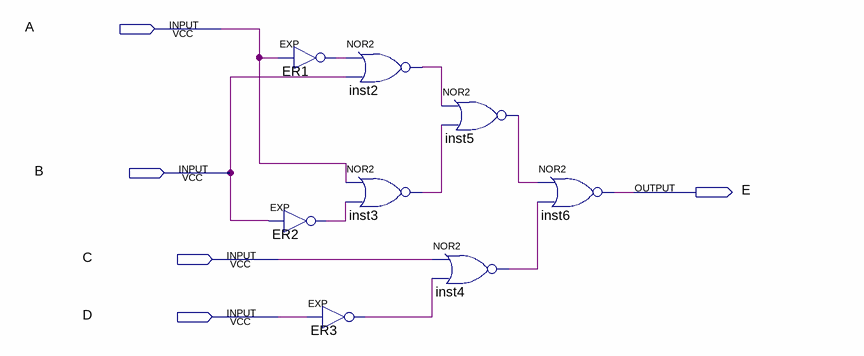
[diagram p0: schematic sheet]
// Quartus schematic lab1.bdf as structural Verilog: 8 symbols, 5 pins
module lab1 (
  input  A,
  input  B,
  input  C,
  input  D,
  output E
);

  wire ER1_out, ER2_out, ER3_out, inst2_out, inst3_out, inst4_out, inst5_out;

  EXP ER1 (.IN(A), .OUT(ER1_out));
  EXP ER2 (.IN(B), .OUT(ER2_out));
  EXP ER3 (.IN(D), .OUT(ER3_out));
  nor inst2 (inst2_out, ER1_out, B);
  nor inst3 (inst3_out, A, ER2_out);
  nor inst5 (inst5_out, inst2_out, inst3_out);
  nor inst4 (inst4_out, C, ER3_out);
  nor inst6 (E, inst5_out, inst4_out);
endmodule
